# EasyEDA Pro project ProPrj_LeTian-robot2（轮腿机器人）_2025-09-12.epro, schematic 4010motor-SCH
Page Name: P1; Project Name: LeTian-robot2（轮腿机器人）; Schematic Name: 4010motor-SCH; Update Date: 2022-11-28
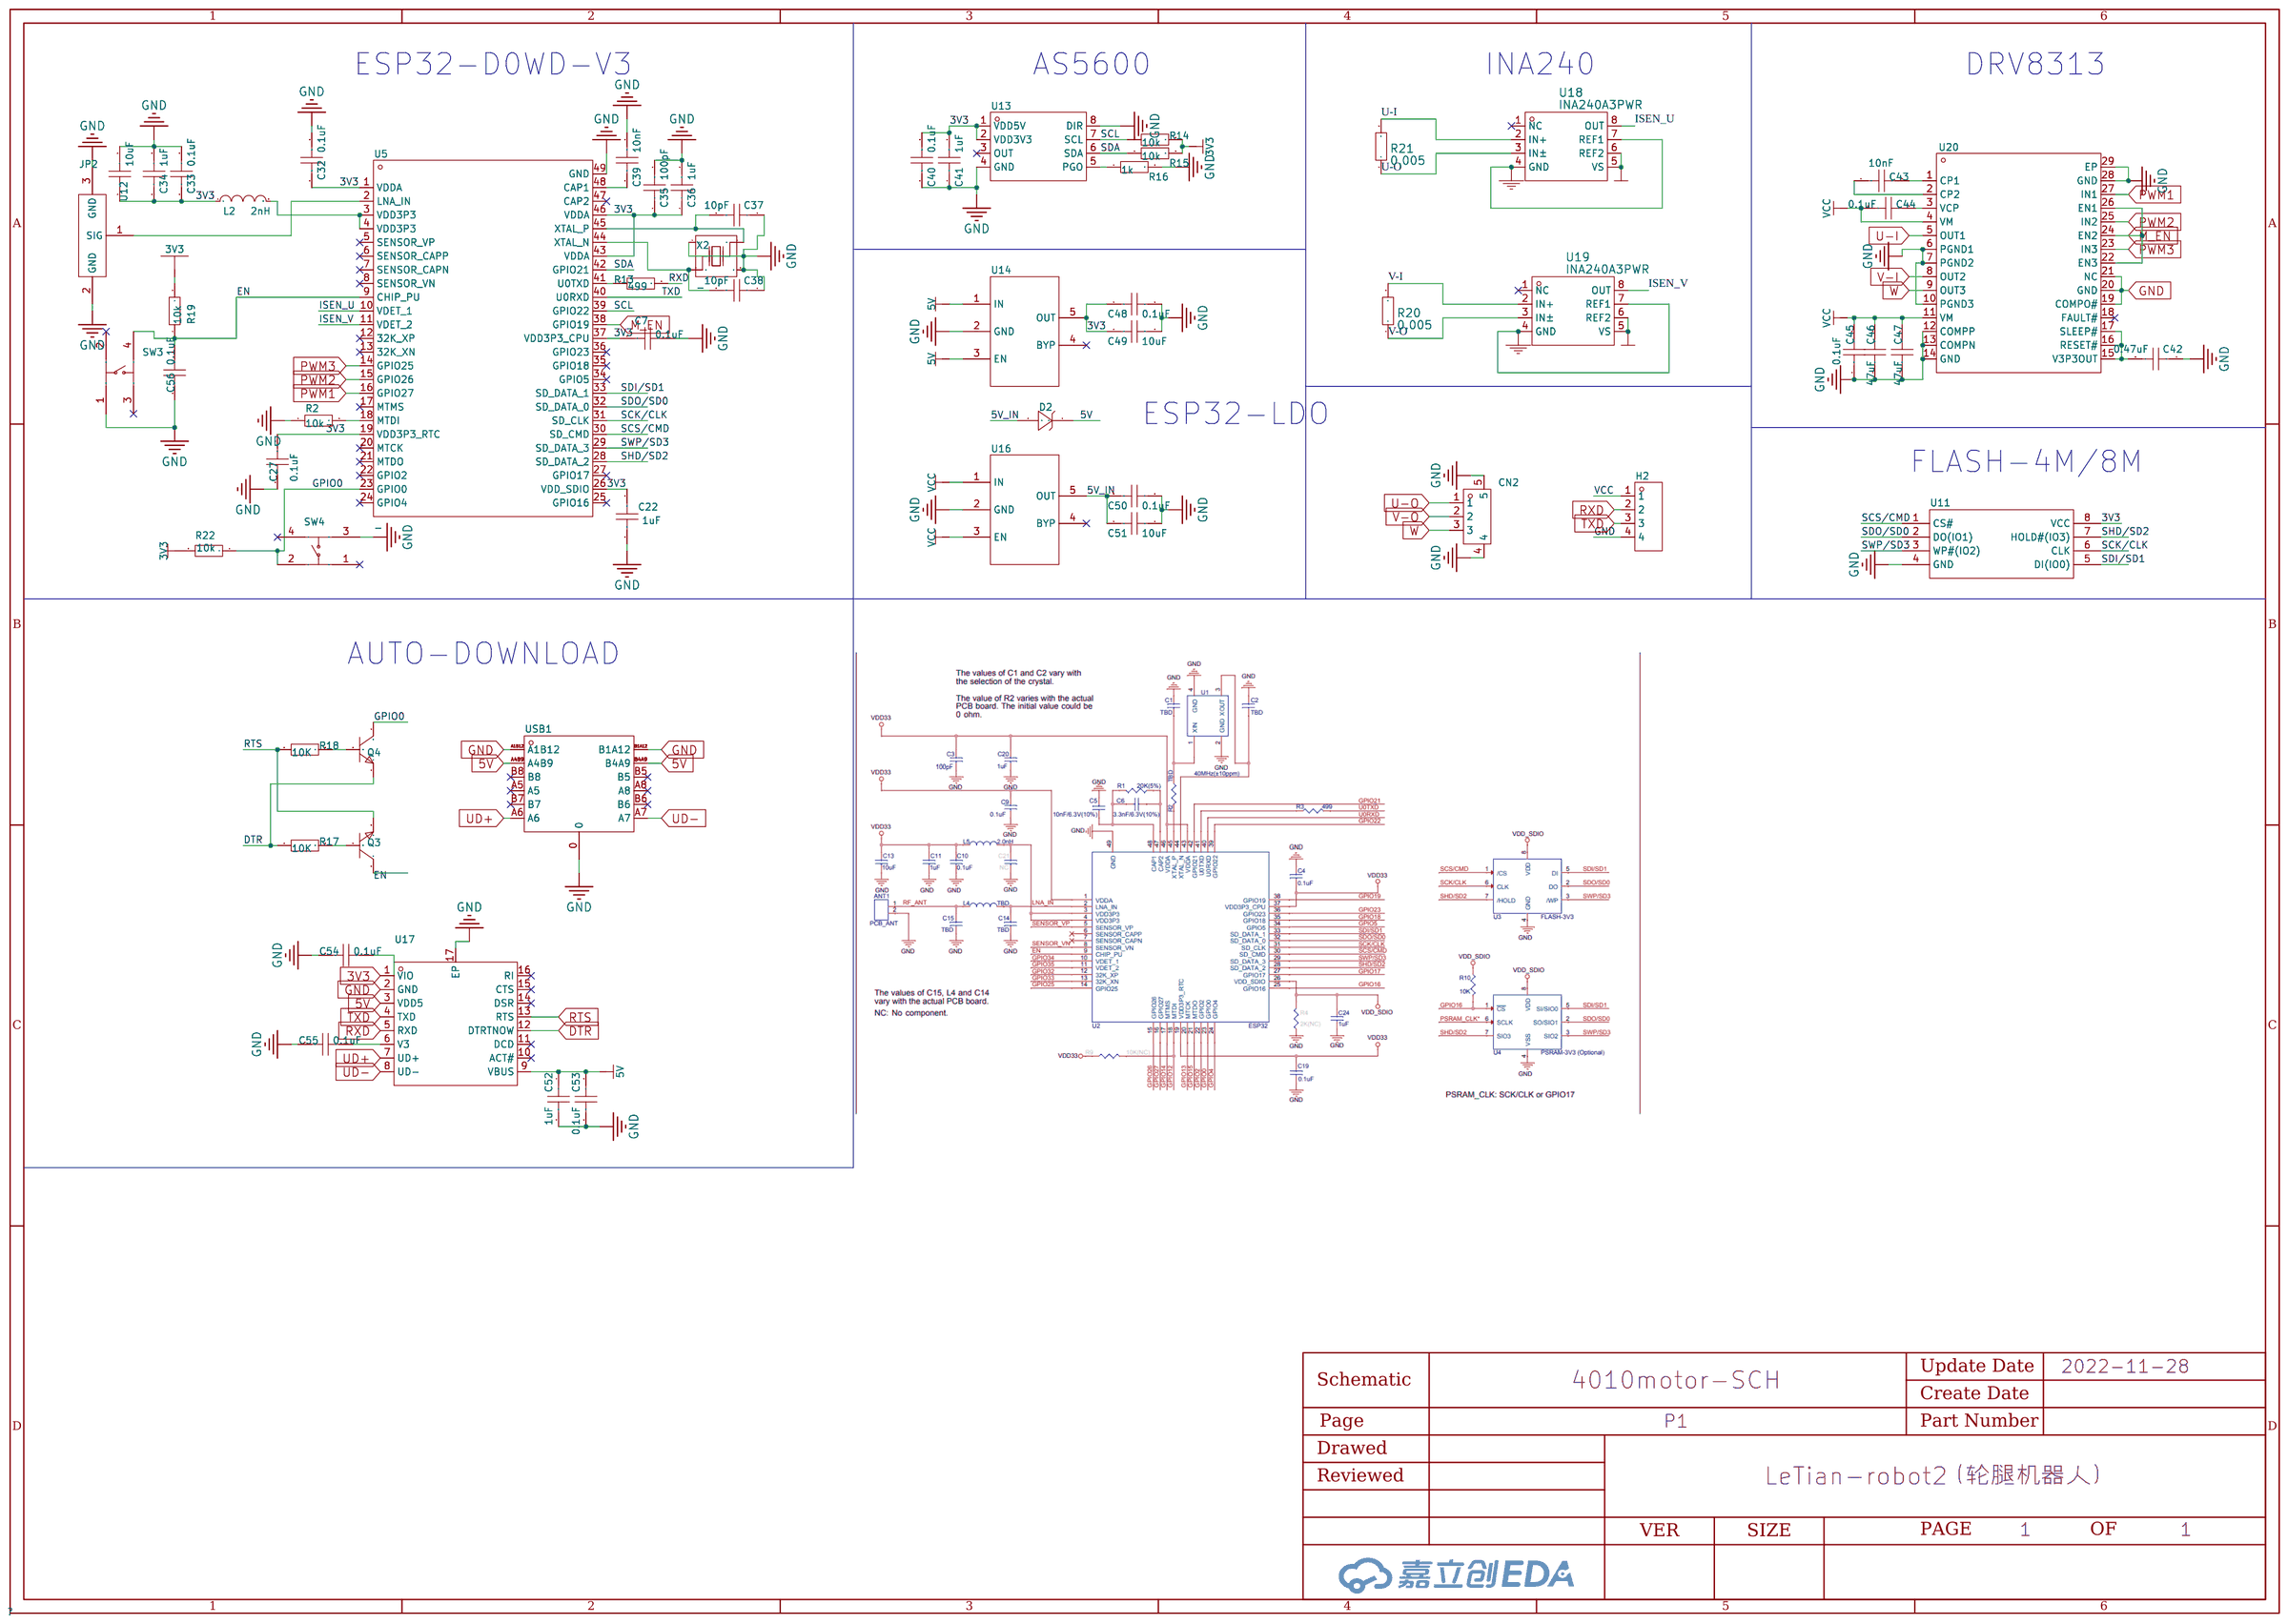
[diagram p0: schematic sheet]

## Parts
C7  0.1uF  [C0603]
C22  1uF  [C0603]
C27  0.1uF  [C0603]
C32  0.1uF  [C0603]
C33  0.1uF  [C0603]
C34  1uF  [C0603]
C35  100pF  [C0603]
C36  1uF  [C0603]
C37  10pF  [C0603]
C38  10pF  [C0603]
C39  10nF  [C0603]
C40  0.1uF  [C0603]
C41  1uF  [C0603]
C42  0.47uF  [C0603]
C43  10nF  [C0603]
C44  0.1uF  [C0603]
C45  0.1uF  [C0603]
C46  47uF  [C1812]
C47  47uF  [C1812]
C48  0.1uF  [C0603]
C49  10uF  [C0603]
C50  0.1uF  [C0603]
C51  10uF  [C0603]
C52  1uF  [C0603]
C53  0.1uF  [C0603]
C54  0.1uF  [C0603]
C55  0.1uF  [C0603]
C56  0.1uF  [C0603]
CN2  HDGC1002WR-S-3P  [CONN-SMD_3P-P1.00_HDGC_HDGC1002WR-S-3P]
D2  K24  [SOD-123FL_L2.8-W1.9-LS3.7-RD]
H2  -  [排针 4P]
JP2  U.FL-R-SMT-1(80)  [RF-SMD_FRF05002-JSS103M]
L2  2nH  [L0603]
Q3  SS8050  [SOT-23-3_L2.9-W1.3-P1.90-LS2.4-BR]
Q4  SS8050  [SOT-23-3_L2.9-W1.3-P1.90-LS2.4-BR]
R2  10k  [R0603]
R13  499  [R0603]
R14  10k  [R0603]
R15  10k  [R0603]
R16  1k  [R0603]
R17  10K  [R0603]
R18  10K  [R0603]
R19  10k  [R0603]
R20  0.005  [R1206_1]
R21  0.005  [R1206_1]
R22  10k  [R0603]
SW3  -  [KEY-SMD_4P-L4.2-W3.2-P2.20-LS5.1-TL]
SW4  -  [KEY-SMD_4P-L4.2-W3.2-P2.20-LS5.1-TL]
U5  -  [QFN-48_L5.0-W5.0-P0.35-BL-EP3.7]
U11  W25Q80DVSSIG  [SOIC-8_L5.3-W5.3-P1.27-LS8.0-BL]
U12  10uF  [C0603]
U13  AS5600-ASOT  [SOIC-8_L5.0-W4.0-P1.27-LS6.0-BL]
U14  SPX3819M5-L-3-3/TR  [SOT-23-5_L3.0-W1.7-P0.95-LS2.8-BR]
U16  SPX3819M5-L-5-0/TR  [SOT-23-5_L3.0-W1.7-P0.95-LS2.8-TL]
U17  CH343P  [TQFN-16_L3.0-W3.0-P0.50-BL-EP1.7]
U18  INA240A3PWR  [TSSOP-8_L4.4-W3.0-P0.65-LS6.4-BL-2]
U19  INA240A3PWR  [TSSOP-8_L4.4-W3.0-P0.65-LS6.4-BL-2]
U20  DRV8313PWPR  [HTSSOP-28_L9.8-W4.5-P0.65-LS6.6-BL-EP]
USB1  TYPE-C 16P CB0.8 073  [USB-C-SMD_TYPE-C-16P-CB0.8-073]
X2  -  [CRYSTAL-SMD_4P-L3.2-W2.5-BL]

## Library data of the parts
C7 C27 C32 C33 C40 C44 C45 C48 C50 C53-C55 = CL10B104KB8NNNC: 容值:100nF;精度:±10%;额定电压:50V;材质(温度系数):X7R;; LCSC Part Name: 100nF ±10% 50V; Supplier Part: C282519; Manufacturer: SAMSUNG(三星); Supplier Footprint: 0603; JLCPCB Part Class: Extended Part; Datasheet: https://atta.szlcsc.com/upload/public/pdf/source/20160103/1457707680512.pdf; Supplier: LCSC; Tolerance: ±10%; Voltage Rated: 50V; Temperature Coefficient: X7R
C22 C34 C36 C41 C52 = CL10B104KB8NNNC: 容值:100nF;精度:±10%;额定电压:50V;材质(温度系数):X7R;; LCSC Part Name: 100nF ±10% 50V; Supplier Part: C36577; Manufacturer: SAMSUNG(三星); Supplier Footprint: 0603; JLCPCB Part Class: Extended Part; Datasheet: https://atta.szlcsc.com/upload/public/pdf/source/20160103/1457707680512.pdf; Supplier: LCSC; Tolerance: ±10%; Voltage Rated: 50V; Temperature Coefficient: X7R
C35 = CL10B104KB8NNNC: 容值:100nF;精度:±10%;额定电压:50V;材质(温度系数):X7R;; LCSC Part Name: 100nF ±10% 50V; Supplier Part: C882529; Manufacturer: SAMSUNG(三星); Supplier Footprint: 0603; JLCPCB Part Class: Extended Part; Datasheet: https://atta.szlcsc.com/upload/public/pdf/source/20160103/1457707680512.pdf; Supplier: LCSC; Tolerance: ±10%; Voltage Rated: 50V; Temperature Coefficient: X7R
C37 C38 = CL10B104KB8NNNC: 容值:100nF;精度:±10%;额定电压:50V;材质(温度系数):X7R;; LCSC Part Name: 100nF ±10% 50V; Supplier Part: C597128; Manufacturer: SAMSUNG(三星); Supplier Footprint: 0603; JLCPCB Part Class: Extended Part; Datasheet: https://atta.szlcsc.com/upload/public/pdf/source/20160103/1457707680512.pdf; Supplier: LCSC; Tolerance: ±10%; Voltage Rated: 50V; Temperature Coefficient: X7R
C39 C43 = CL10B104KB8NNNC: 容值:100nF;精度:±10%;额定电压:50V;材质(温度系数):X7R;; LCSC Part Name: 100nF ±10% 50V; Supplier Part: C346187; Manufacturer: SAMSUNG(三星); Supplier Footprint: 0603; JLCPCB Part Class: Extended Part; Datasheet: https://atta.szlcsc.com/upload/public/pdf/source/20160103/1457707680512.pdf; Supplier: LCSC; Tolerance: ±10%; Voltage Rated: 50V; Temperature Coefficient: X7R
C42 = CL10B104KB8NNNC: 容值:100nF;精度:±10%;额定电压:50V;材质(温度系数):X7R;; LCSC Part Name: 100nF ±10% 50V; Supplier Part: C694503; Manufacturer: SAMSUNG(三星); Supplier Footprint: 0603; JLCPCB Part Class: Extended Part; Datasheet: https://atta.szlcsc.com/upload/public/pdf/source/20160103/1457707680512.pdf; Supplier: LCSC; Tolerance: ±10%; Voltage Rated: 50V; Temperature Coefficient: X7R
C46 C47 = FH12X222K302EGG: 等级:X2;容值:2.2nF;精度:±10%;; LCSC Part Name: 等级:X2 2.2nF ±10%; Supplier Part: C784078; Manufacturer: PSA(信昌电陶); Supplier Footprint: 1812; JLCPCB Part Class: Extended Part; Datasheet: https://atta.szlcsc.com/upload/public/pdf/source/20200506/C436246_4EAA78C9048D88437BAF2CB7B8BE45FD.pdf; Supplier: LCSC; Subclass: X2; Tolerance: ±10%
C49 C51 = CL10B104KB8NNNC: 容值:100nF;精度:±10%;额定电压:50V;材质(温度系数):X7R;; LCSC Part Name: 100nF ±10% 50V; Supplier Part: C669868; Manufacturer: SAMSUNG(三星); Supplier Footprint: 0603; JLCPCB Part Class: Extended Part; Datasheet: https://atta.szlcsc.com/upload/public/pdf/source/20160103/1457707680512.pdf; Supplier: LCSC; Tolerance: ±10%; Voltage Rated: 50V; Temperature Coefficient: X7R
C56 = CC0603KRX7R9BB104: 容值:100nF;精度:±10%;额定电压:50V;温度系数:X7R;; LCSC Part Name: 100nF ±10% 50V; Supplier Part: C282519; Manufacturer: YAGEO(国巨); Supplier Footprint: 0603; JLCPCB Part Class: Basic Part; Datasheet: https://atta.szlcsc.com/upload/public/pdf/source/20170116/1484561234239.pdf; Supplier: LCSC; Tolerance: ±10%; Voltage Rated: 50V; Temperature Coefficient: X7R
CN2 = HDGC1002WR-S-3P: 参考系列:-;间距:1mm;插针结构:1x3P;排数:1;每排PIN数:3;行距:-;公母:公型插针;安装方式:卧贴;额定电流:1A;工作温度范围:-25~+70;; LCSC Part Name: SH1.0针座卧贴 3P; Supplier Part: C2936213; Manufacturer: HDGC(华德共创); Supplier Footprint: SMD,P=1mm; JLCPCB Part Class: Extended Part; Datasheet: https://atta.szlcsc.com/upload/public/pdf/source/20211229/E8A09E85670B5E97244D2008A24D97FE.pdf; Supplier: LCSC; Pitch: 1mm; Pins Structure: 1x3P; Number of Rows: 1; Number of PINs Per Row: 3; Gender: 公型插针; Mounting Style: 卧贴; Current Rating (Max): 1A; Operating Temperature Range: -25~+70
D2 = K24: 二极管配置:独立式;直流反向耐压(Vr):40V;平均整流电流(Io):2A;正向压降(Vf):550mV@2A;反向电流(Ir):200uA@40V;; LCSC Part Name: 40V 2A 550mV@2A; Supplier Part: C908664; Manufacturer: GOODWORK(固得沃克); Supplier Footprint: SOD-123FL; JLCPCB Part Class: Extended Part; Datasheet: https://atta.szlcsc.com/upload/public/pdf/source/20201231/C908664_098C0944B619E56B4DBC92214488B419.pdf; Supplier: LCSC; Diode Configuration: 独立式; Reverse Voltage (Vr): 40V; Average Rectified Current (Io): 2A; Forward Voltage (Vf@If): 550mV@2A; Reverse Leakage Current (Ir): 200uA@40V
H2 = 贴片排针
JP2 = U.FL-R-SMT-1(80)_C88374: LCSC Part Name: 3310472280，IPE-X板端 IPX接头，贴片; Supplier Part: C88374; Manufacturer: HRS(广濑); Supplier Footprint: SMD; JLCPCB Part Class: Extended Part; Datasheet: https://atta.szlcsc.com/upload/public/pdf/source/20161125/1480067868647.pdf; Supplier: LCSC
L2 = VHF160808H2N0ST: 电感值:2nH;精度:±0.3nH;额定电流:-;饱和电流(Isat):-;直流电阻(DCR):-;; LCSC Part Name: 2nH ±0.3nH; Supplier Part: C395081; Manufacturer: FH(风华); Supplier Footprint: 0603; JLCPCB Part Class: Extended Part; Datasheet: https://atta.szlcsc.com/upload/public/pdf/source/20190725/C395081_ACBEF248532953C24771EA47F36925CC.pdf; Supplier: LCSC; Tolerance: ±0.3nH
Q3 Q4 = SS8050_C916392: 晶体管类型:-;集射极击穿电压(Vceo):-;集电极电流(Ic):-;功率(Pd):-;集电极截止电流(Icbo):-;集电极-发射极饱和电压(VCE(sat)@Ic,Ib):-;直流电流增益(hFE@Ic,Vce):-;特征频率(fT):-;; Supplier Part: C916392; Manufacturer: JSMSEMI(杰盛微); Supplier Footprint: SOT-23; JLCPCB Part Class: Extended Part; Datasheet: https://atta.szlcsc.com/upload/public/pdf/source/20211201/0A8CEC4FF7E91679BCF495428691A716.pdf; Supplier: LCSC
R2 R14 R15 R17 R18 = 0603WAF1002T5E: 电阻类型:厚膜电阻;阻值:10kΩ;精度:±1%;功率:100mW;温度系数:±100ppm/;最大工作电压:75V;工作温度范围:-55~+155;; LCSC Part Name: 10kΩ ±1% 100mW; Supplier Part: C25804; Manufacturer: UNI-ROYAL(厚声); Supplier Footprint: 0603; JLCPCB Part Class: Basic Part; Datasheet: https://atta.szlcsc.com/upload/public/pdf/source/20200306/C422600_1E6D84923E4A46A82E41ADD87F860B5C.pdf; Supplier: LCSC; Type: 厚膜电阻; Tolerance: ±1%; Power(Watts): 100mW; Temperature Coefficient: ±100ppm/; Overload Voltage (Max): 75V; Operating Temperature Range: -55~+155
R13 = 0603WAF1002T5E: 电阻类型:厚膜电阻;阻值:10kΩ;精度:±1%;功率:100mW;温度系数:±100ppm/;最大工作电压:75V;工作温度范围:-55~+155;; LCSC Part Name: 10kΩ ±1% 100mW; Supplier Part: C374575; Manufacturer: UNI-ROYAL(厚声); Supplier Footprint: 0603; JLCPCB Part Class: Basic Part; Datasheet: https://atta.szlcsc.com/upload/public/pdf/source/20200306/C422600_1E6D84923E4A46A82E41ADD87F860B5C.pdf; Supplier: LCSC; Type: 厚膜电阻; Tolerance: ±1%; Power(Watts): 100mW; Temperature Coefficient: ±100ppm/; Overload Voltage (Max): 75V; Operating Temperature Range: -55~+155
R16 = 0603WAF1002T5E: 电阻类型:厚膜电阻;阻值:10kΩ;精度:±1%;功率:100mW;温度系数:±100ppm/;最大工作电压:75V;工作温度范围:-55~+155;; LCSC Part Name: 10kΩ ±1% 100mW; Supplier Part: C2092521; Manufacturer: UNI-ROYAL(厚声); Supplier Footprint: 0603; JLCPCB Part Class: Basic Part; Datasheet: https://atta.szlcsc.com/upload/public/pdf/source/20200306/C422600_1E6D84923E4A46A82E41ADD87F860B5C.pdf; Supplier: LCSC; Type: 厚膜电阻; Tolerance: ±1%; Power(Watts): 100mW; Temperature Coefficient: ±100ppm/; Overload Voltage (Max): 75V; Operating Temperature Range: -55~+155
R19 R22 = TR0603B10K0P0525Z: 电阻类型:薄膜电阻;阻值:10k;精度:±0.1%;功率:100mW;温度系数:±25ppm/;最大工作电压:75V;工作温度范围:-55~+155;; LCSC Part Name: 10k ±0.1% 100mW; Supplier Part: C188363; Manufacturer: EVER OHMS(天二科技); Supplier Footprint: 0603; JLCPCB Part Class: Extended Part; Datasheet: https://atta.szlcsc.com/upload/public/pdf/source/20190415/C188363_433BF05B6FB8F7A0F5F35A3E4390C55A.pdf; Supplier: LCSC; Type: 薄膜电阻; Tolerance: ±0.1%; Power(Watts): 100mW; Temperature Coefficient: ±25ppm/; Overload Voltage (Max): 75V; Operating Temperature Range: -55~+155
R20 R21 = 0.005: link: https://item.szlcsc.com/311874.html; 3DModel: R1206_L3.2-W1.6-H0.6; Supplier: LCSC; Manufacturer: RALEC; Manufacturer Part: RTT06R010FTP; Supplier Part: C346482
SW3 SW4 = K2-1808GN-A4SW-04: 触点电流:50mA;额定电压(DC):12V;绝缘电阻:100M;电路结构:单刀单掷;安装方式:立贴;按钮形状:椭圆形按钮;带灯:-;作用力:250gf@±30gf;机械寿命:100000;工作温度:-25~+85;开关长度:4.2mm;开关宽度:3.25mm;开关高度:2.5mm;; Supplier Part: C283535; Manufacturer: 韩国韩荣; Supplier Footprint: SMD; JLCPCB Part Class: Extended Part; Datasheet: https://atta.szlcsc.com/upload/public/pdf/source/20180927/C283535_7E7907F3E7B6C1691E1DC87E363D082A.pdf; Supplier: LCSC; Contact Current: 50mA; Voltage Rating (DC): 12V; Insulation Resistance: 100M; Circuit: 单刀单掷; Mounting Style: 立贴; Actuator Style: 椭圆形按钮; Operating Force: 250gf@±30gf; Mechanical Life: 100000; Operating Temperature: -25~+85; Switch Length: 4.2mm; Switch Width: 3.25mm; Switch Height: 2.5mm
U5 = ESP32-D0WD-V3: 类型:-;作业频率:-;输出功率:-;接口类型:-;工作电压:-;; Supplier Part: C967021; Manufacturer: ESPRESSIF 乐鑫; Supplier Footprint: QFN-48; JLCPCB Part Class: Extended Part; Datasheet: https://atta.szlcsc.com/upload/public/pdf/source/20201208/C967021_39FFD09C951515412BAF6B5507592920.pdf; Supplier: LCSC
U11 = W25Q80DVSSIG_C14086: 存储器类型:Non-Volatile;存储器构架(格式):FLASH;存储器容量:8Mb (1M x 8);存储器接口类型:SPI - Dual/Quad I/O;; Supplier Part: C179173; Manufacturer: WINBOND(华邦); Supplier Footprint: SOIC-8_208mil; JLCPCB Part Class: Extended Part; Datasheet: https://atta.szlcsc.com/upload/public/pdf/source/20150601/1457707315451.pdf; Supplier: LCSC; Memory Type: Non-Volatile; Memory Format: FLASH; Memory Size: 8Mb (1M x 8); Memory Interface: SPI - Dual/Quad I/O; Voltage - Supply: 2.7V ~ 3.6V
U12 = GRM188C80G106KE47D: 容值:10uF;精度:±10%;额定电压:-;材质(温度系数):-;; LCSC Part Name: 10uF ±10%; Supplier Part: C669868; Manufacturer: muRata(村田); Supplier Footprint: 0603; JLCPCB Part Class: Extended Part; Datasheet: https://atta.szlcsc.com/upload/public/pdf/source/20210205/C710916_8901BCC8D8E6CC54F2C999D22152DEF1.pdf; Supplier: LCSC; Tolerance: ±10%
U13 = AS5600-ASOT: Supplier Part: C499458; Manufacturer: ams(艾迈斯半导体); Supplier Footprint: SOIC-8; JLCPCB Part Class: Extended Part; Datasheet: https://atta.szlcsc.com/upload/public/pdf/source/20200324/C499458_E1461AFB0CE1042DE5756821C534625C.pdf; Supplier: LCSC
U14 = SPX3819M5-L-3-3/TR: 输出类型:固定;输出极性:正;输出通道数:1;最大输入电压:16V;输出电压:3.3V;压差:700mV@(500mA);输出电流:500mA;电源纹波抑制比(PRSS):70dB;; LCSC Part Name: Vin=16V Vout=3.3V 500mA 70dB; Supplier Part: C9055; Manufacturer: MaxLinear; Supplier Footprint: SOT-23-5; JLCPCB Part Class: Extended Part; Datasheet: https://atta.szlcsc.com/upload/public/pdf/source/20160421/1461205045150.pdf; Supplier: LCSC; Output Type: 固定; Output Polarity: 正; Number of Outputs: 1; Maximum Input Voltage: 16V; Output Voltage: 3.3V; Dropout Voltage: 700mV@(500mA); Output Current: 500mA; Power Supply Rejection Ratio (PRSS): 70dB
U16 = SPX3819M5-L-5-0/TR: 输出类型:固定;输出极性:正;输出通道数:1;最大输入电压:16V;输出电压:5V;压差:700mV@(500mA);输出电流:500mA;电源纹波抑制比(PRSS):-;; LCSC Part Name: Vin=16V Vout=5V 500mA; Supplier Part: C13417; Manufacturer: MaxLinear; Supplier Footprint: SOT-23-5; JLCPCB Part Class: Extended Part; Datasheet: https://atta.szlcsc.com/upload/public/pdf/source/20150720/1457707331934.pdf; Supplier: LCSC; Output Type: 固定; Output Polarity: 正; Number of Outputs: 1; Maximum Input Voltage: 16V; Output Voltage: 5V; Dropout Voltage: 700mV@(500mA); Output Current: 500mA
U17 = CH343P: 类型:-;协议类别:-;驱动器/接收器数:-;数据速率:-;; Supplier Part: C2846043; Manufacturer: WCH(南京沁恒); Supplier Footprint: QFN-16; JLCPCB Part Class: Extended Part; Datasheet: https://atta.szlcsc.com/upload/public/pdf/source/20211010/C2846043_7FA705E1F14A2906F6A2AFA45FA28209.pdf; Supplier: LCSC
U18 U19 = INA240A3PWR: link: https://item.szlcsc.com/109288.html; 3DModel: TSSOP-8_L3.0-W4.4-H1.0-LS6.4-P0.65; Supplier: LCSC; Supplier Part: C544538; Manufacturer: TI(德州仪器); JLCPCB Part Class: Extended Part
U20 = DRV8313PWPR: DRV8313 三路 1/2 H 桥驱动器 IC; Supplier Part: C92482; Manufacturer: TI(德州仪器); Supplier Footprint: HTSSOP-28; JLCPCB Part Class: Extended Part; Datasheet: https://atta.szlcsc.com/upload/public/pdf/source/20180307/C92482_15204091381071407760.pdf; Supplier: LCSC
USB1 = TYPE-C 16P CB0.8 073: 连接器类型:Type-C;标准:-;公母:母座;触点数量:16;端口数量:1;安装方式:沉板;额定电流 - 电源:3A;工作温度范围:-25~+85;; LCSC Part Name: Type-C 母座 沉板 沉板0.8 不锈钢外壳 2次模顶; Supplier Part: C2906289; Manufacturer: SHOU HAN(首韩); Supplier Footprint: SMD; JLCPCB Part Class: Extended Part; Datasheet: https://atta.szlcsc.com/upload/public/pdf/source/20211019/7FB277F3E208FF6FA6B4F1FC2FE8DDC1.pdf; Supplier: LCSC; Connector Type: Type-C; Gender: 母座; Number of Contacts: 16; Number of Ports: 1; Mounting Style: 沉板; Current Rating - Power (Max): 3A; Operating Temperature Range: -25~+85
X2 = 7325-4000A1510-00: 晶振类型:-;频率:-;频率公差:-;负载电容:-;工作温度:-;; LCSC Part Name: 贴片晶振/4脚贴片晶振 3225 40.000M15PF±10PPM; Supplier Part: C389926; Manufacturer: XTY(新天源); Supplier Footprint: SMD3225-4P; JLCPCB Part Class: Extended Part; Datasheet: https://atta.szlcsc.com/upload/public/pdf/source/20190701/C389926_E8BBEC4EB371B12680EEA5E74472A3FD.pdf; Supplier: LCSC

## Nets
3V3: C7.1 C22.1 C27.2 C32.1 C33.1 C34.1 C35.1 C36.1 C40.2 C41.2 C48.1 C49.1 C54.2 L2.1 R14.2 R15.2 R19.2 R22.2 U5.1(VDDA) U5.19(VDD3P3_RTC) U5.26(VDD_SDIO) U5.37(VDD3P3_CPU) U5.43(VDDA) U5.46(VDDA) U11.8(VCC) U12.1 U13.1(VDD5V) U13.2(VDD3V3) U14.5(OUT) U17.1(VIO) U18.5(VS) U18.6(REF2) U19.5(VS) U19.6(REF2)
5V: C52.1 C53.1 D2.1 U14.1(IN) U14.3(EN) U17.3(VDD5) U17.9(VBUS) USB1.A4B9 USB1.B4A9
5V_IN: C50.1 C51.1 D2.2 U16.5(OUT)
GND: C7.2 C22.2 C27.1 C32.2 C33.2 C34.2 C35.2 C36.2 C37.1 C38.1 C39.2 C40.1 C41.1 C42.1 C45.1 C46.1 C47.1 C48.2 C49.2 C50.2 C51.2 C52.2 C53.2 C54.1 C55.1 C56.1 CN2.4 CN2.5 H2.4 JP2.2(GND) JP2.3(GND) R2.1 R16.2 SW3.1 SW4.3 U5.49(GND) U11.4(GND) U12.2 U13.4(GND) U13.8(DIR) U14.2(GND) U16.2(GND) U17.2(GND) U17.17(EP) U18.4(GND) U18.7(REF1) U19.4(GND) U19.7(REF1) U20.6(PGND1) U20.7(PGND2) U20.10(PGND3) U20.12(COMPP) U20.13(COMPN) U20.14(GND) U20.19(COMPO#) U20.20(GND) U20.21(NC) U20.28(GND) U20.29(EP) USB1.0 USB1.A1B12 USB1.B1A12 X2.2 X2.4
VCC: C44.1 C45.2 C46.2 C47.2 H2.1 U16.1(IN) U16.3(EN) U20.4(VM) U20.11(VM)
DTR: Q4.2(E) R17.1 U17.12(DTRTNOW)
EN: C56.2 Q3.3(C) R19.1 SW3.4 U5.9(CHIP_PU)
GPIO0: Q4.3(C) R22.1 SW4.2 U5.23(GPIO0)
ISEN_U: U5.10(VDET_1) U18.8(OUT)
ISEN_V: U5.11(VDET_2) U19.8(OUT)
M_EN: U5.38(GPIO19) U20.22(EN3) U20.24(EN2) U20.26(EN1)
PWM1: U5.16(GPIO27) U20.27(IN1)
PWM2: U5.15(GPIO26) U20.25(IN2)
PWM3: U5.14(GPIO25) U20.23(IN3)
RTS: Q3.2(E) R18.1 U17.13(RTS)
RXD: H2.2 R13.2 U17.5(RXD)
SCK/CLK: U5.31(SD_CLK) U11.6(CLK)
SCL: R14.1 U5.39(GPIO22) U13.7(SCL)
SCS/CMD: U5.30(SD_CMD) U11.1(CS#)
SDA: R15.1 U5.42(GPIO21) U13.6(SDA)
SDI/SD1: U5.33(SD_DATA_1) U11.5(DI(IO0))
SDO/SD0: U5.32(SD_DATA_0) U11.2(DO(IO1))
SHD/SD2: U5.28(SD_DATA_2) U11.7(HOLD#(IO3))
SWP/SD3: U5.29(SD_DATA_3) U11.3(WP#(IO2))
TXD: H2.3 U5.40(U0RXD) U17.4(TXD)
U-I: R21.2 U18.2(IN+) U20.5(OUT1)
U-O: CN2.1 R21.1 U18.3(IN±)
UD+: U17.7(UD+) USB1.A6
UD-: U17.8(UD-) USB1.A7
V-I: R20.2 U19.2(IN+) U20.8(OUT2)
V-O: CN2.2 R20.1 U19.3(IN±)
W: CN2.3 U20.9(OUT3)
Net-(C37-2): C37.2 U5.45(XTAL_P) X2.3
Net-(C38-2): C38.2 U5.44(XTAL_N) X2.1
Net-(C39-1): C39.1 U5.48(CAP1)
Net-(C42-2): C42.2 U20.15(V3P3OUT) U20.16(RESET#) U20.17(SLEEP#)
Net-(C43-1): C43.1 U20.2(CP2)
Net-(C43-2): C43.2 U20.1(CP1)
Net-(C44-2): C44.2 U20.3(VCP)
Net-(C55-2): C55.2 U17.6(V3)
Net-(JP2-1): JP2.1(SIG) U5.2(LNA_IN)
Net-(L2-2): L2.2 U5.3(VDD3P3) U5.4(VDD3P3)
Net-(Q3-1): Q3.1(B) R17.2
Net-(Q4-1): Q4.1(B) R18.2
Net-(R2-2): R2.2 U5.18(MTDI)
Net-(R13-1): R13.1 U5.41(U0TXD)
Net-(R16-1): R16.1 U13.5(PGO)

Not connected (* = marked no-connect by the designer): SW3 2* 3*; SW4 1* 4*; U5 5(SENSOR_VP)* 6(SENSOR_CAPP)* 7(SENSOR_CAPN)* 8(SENSOR_VN)* 12(32K_XP)* 13(32K_XN)* 17(MTMS)* 20(MTCK)* 21(MTDO)* 22(GPIO2)* 24(GPIO4)* 25(GPIO16)* 27(GPIO17)* 34(GPIO5)* 35(GPIO18)* 36(GPIO23)* 47(CAP2)*; U13 3(OUT)*; U14 4(BYP)*; U16 4(BYP)*; U17 10(ACT#)* 11(DCD)* 14(DSR)* 15(CTS)* 16(RI)*; U18 1(NC)*; U19 1(NC)*; U20 18(FAULT#)*; USB1 A5* A8* B5* B6* B7* B8*

## Notes on the sheet
- ESP32-D0WD-V3
- AS5600
- INA240
- DRV8313
- ESP32-LDO
- FLASH-4M/8M
- AUTO-DOWNLOAD
